# Altium schematic sheet 03_Temp_Sensor.SchDoc
size A4; SheetNumber: 3; SheetTotal: 9
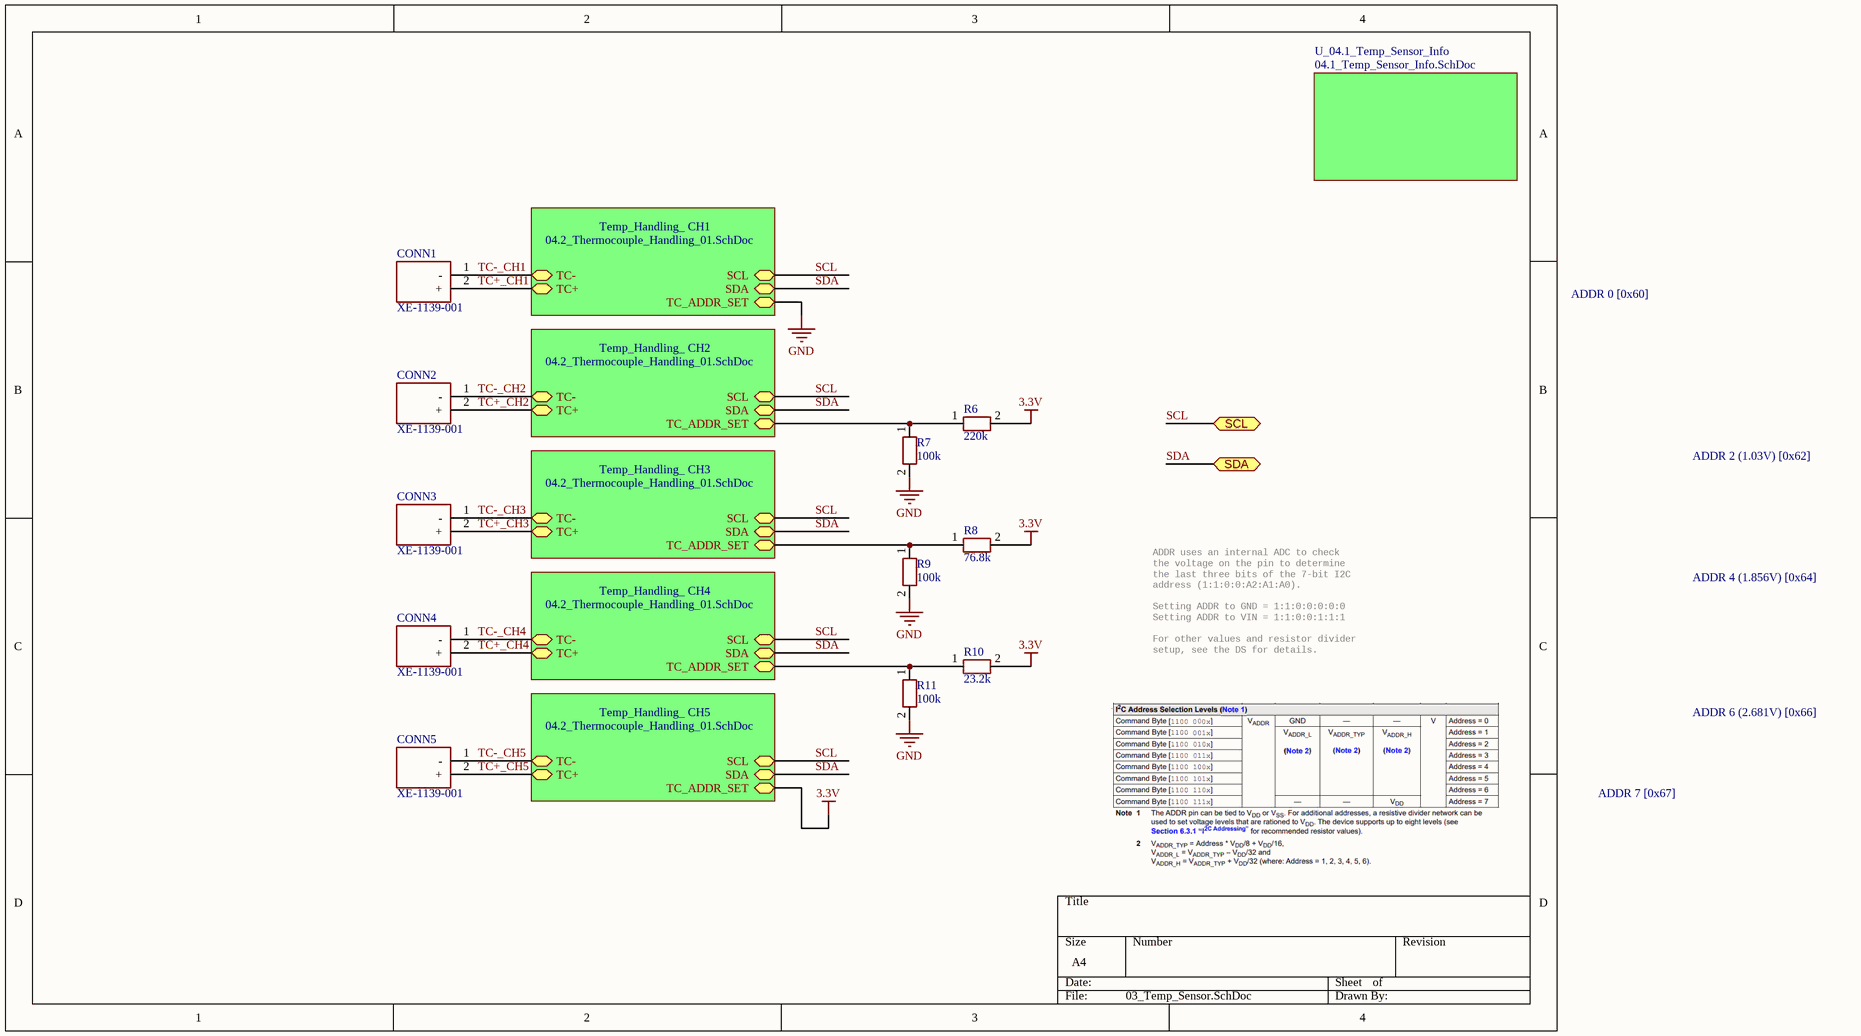
[diagram p0: 03_Temp_Sensor.SchDoc]

## Parts
CONN1  XE-1139-001  [AM-K PCB XE-1139-001]
CONN2  XE-1139-001  [AM-K PCB XE-1139-001]
CONN3  XE-1139-001  [AM-K PCB XE-1139-001]
CONN4  XE-1139-001  [AM-K PCB XE-1139-001]
CONN5  XE-1139-001  [AM-K PCB XE-1139-001]
R6  220k  [RESC2012X60N]
R7  100k  [RESC2012X50N]
R8  76.8k  [RESC2012X60N]
R9  100k  [RESC2012X50N]
R10  23.2k  [RESC2012X60N]
R11  100k  [RESC2012X50N]

## Sub-sheets
Temp_Handling_ CH1 = 04.2_Thermocouple_Handling_01.SchDoc: TC+ (bidir), TC- (bidir), SCL (bidir), SDA (bidir), TC_ADDR_SET (bidir)
Temp_Handling_ CH2 = 04.2_Thermocouple_Handling_01.SchDoc: TC+ (bidir), TC- (bidir), SCL (bidir), SDA (bidir), TC_ADDR_SET (bidir)
Temp_Handling_ CH3 = 04.2_Thermocouple_Handling_01.SchDoc: TC+ (bidir), TC- (bidir), SCL (bidir), SDA (bidir), TC_ADDR_SET (bidir)
Temp_Handling_ CH4 = 04.2_Thermocouple_Handling_01.SchDoc: TC+ (bidir), TC- (bidir), SCL (bidir), SDA (bidir), TC_ADDR_SET (bidir)
Temp_Handling_ CH5 = 04.2_Thermocouple_Handling_01.SchDoc: TC+ (bidir), TC- (bidir), SCL (bidir), SDA (bidir), TC_ADDR_SET (bidir)
U_04.1_Temp_Sensor_Info = 04.1_Temp_Sensor_Info.SchDoc: no entries

## Ports
SCL (bidir, see 01_Top[2B], 04.2_Thermocouple_Handling_01[2B], 04_Accelerometer[3B], 06_MCU[6D]), SDA (bidir, see 01_Top[2B], 04.2_Thermocouple_Handling_01[2B], 04_Accelerometer[3C], 06_MCU[6D])

## Nets
3.3V: R6.2 R8.2 R10.2 ; sheet Temp_Handling_ CH5/TC_ADDR_SET
GND: R7.2 R9.2 R11.2 ; sheet Temp_Handling_ CH1/TC_ADDR_SET
SCL: port SCL, sheet Temp_Handling_ CH1/SCL, sheet Temp_Handling_ CH2/SCL, sheet Temp_Handling_ CH3/SCL, sheet Temp_Handling_ CH4/SCL, sheet Temp_Handling_ CH5/SCL
SDA: port SDA, sheet Temp_Handling_ CH1/SDA, sheet Temp_Handling_ CH2/SDA, sheet Temp_Handling_ CH3/SDA, sheet Temp_Handling_ CH4/SDA, sheet Temp_Handling_ CH5/SDA
TC+_CH1: CONN1.2(+) ; sheet Temp_Handling_ CH1/TC+
TC+_CH2: CONN2.2(+) ; sheet Temp_Handling_ CH2/TC+
TC+_CH3: CONN3.2(+) ; sheet Temp_Handling_ CH3/TC+
TC+_CH4: CONN4.2(+) ; sheet Temp_Handling_ CH4/TC+
TC+_CH5: CONN5.2(+) ; sheet Temp_Handling_ CH5/TC+
TC-_CH1: CONN1.1(-) ; sheet Temp_Handling_ CH1/TC-
TC-_CH2: CONN2.1(-) ; sheet Temp_Handling_ CH2/TC-
TC-_CH3: CONN3.1(-) ; sheet Temp_Handling_ CH3/TC-
TC-_CH4: CONN4.1(-) ; sheet Temp_Handling_ CH4/TC-
TC-_CH5: CONN5.1(-) ; sheet Temp_Handling_ CH5/TC-
NetR6_1: R6.1 R7.1 ; sheet Temp_Handling_ CH2/TC_ADDR_SET
NetR8_1: R8.1 R9.1 ; sheet Temp_Handling_ CH3/TC_ADDR_SET
NetR10_1: R10.1 R11.1 ; sheet Temp_Handling_ CH4/TC_ADDR_SET

## Notes on the sheet
- ADDR 0 [0x60]
- ADDR 2 (1.03V) [0x62]
- ADDR 4 (1.856V) [0x64]
- ADDR uses an internal ADC to check
  the voltage on the pin to determine
  the last three bits of the 7-bit I2C
  address (1:1:0:0:A2:A1:A0).
  Setting ADDR to GND = 1:1:0:0:0:0:0
  Setting ADDR to VIN = 1:1:0:0:1:1:1
  For other values and resistor divider
  setup, see the DS for details.
- ADDR 6 (2.681V) [0x66]
- ADDR 7 [0x67]

## Library data of the parts
CONN1-CONN5 = CONN AM-K-PCB XE-1139-001: Thermocouple Type-K Connector; Manufacturer_Part_Number: XE-1139-001; Supplier: DigiKey; ComponentLink1Description: Datasheet; ComponentLink1URL: https://mm.digikey.com/Volume0/opasdata/d220001/medias/docus/6465/XE-1139-001.pdf
R6 = RES 220K 0805 SMD: Resistor; Manufacturer_Part_Number: CR0805-FX-2203ELF
R7 R9 R11 = RES 100K 0805 SMD: Resistor; Manufacturer_Part_Number: CRCW0805100KJNECC
R8 = RES 76.8K 0805 SMD: Resistor; Manufacturer_Part_Number: RC0805FR-0776K8L; ComponentLink1Description: Datasheet; ComponentLink1URL: https://industrial.panasonic.com/cdbs/www-data/pdf/RDA0000/AOA0000C84.pdf
R10 = RES 23.2K 0805 SMD: Resistor; Manufacturer_Part_Number: RC0805FR-0723K2L; ComponentLink1Description: Datasheet; ComponentLink1URL: https://industrial.panasonic.com/cdbs/www-data/pdf/RDA0000/AOA0000C84.pdf